# Altium schematic sheet Alarm.SchDoc
size A4
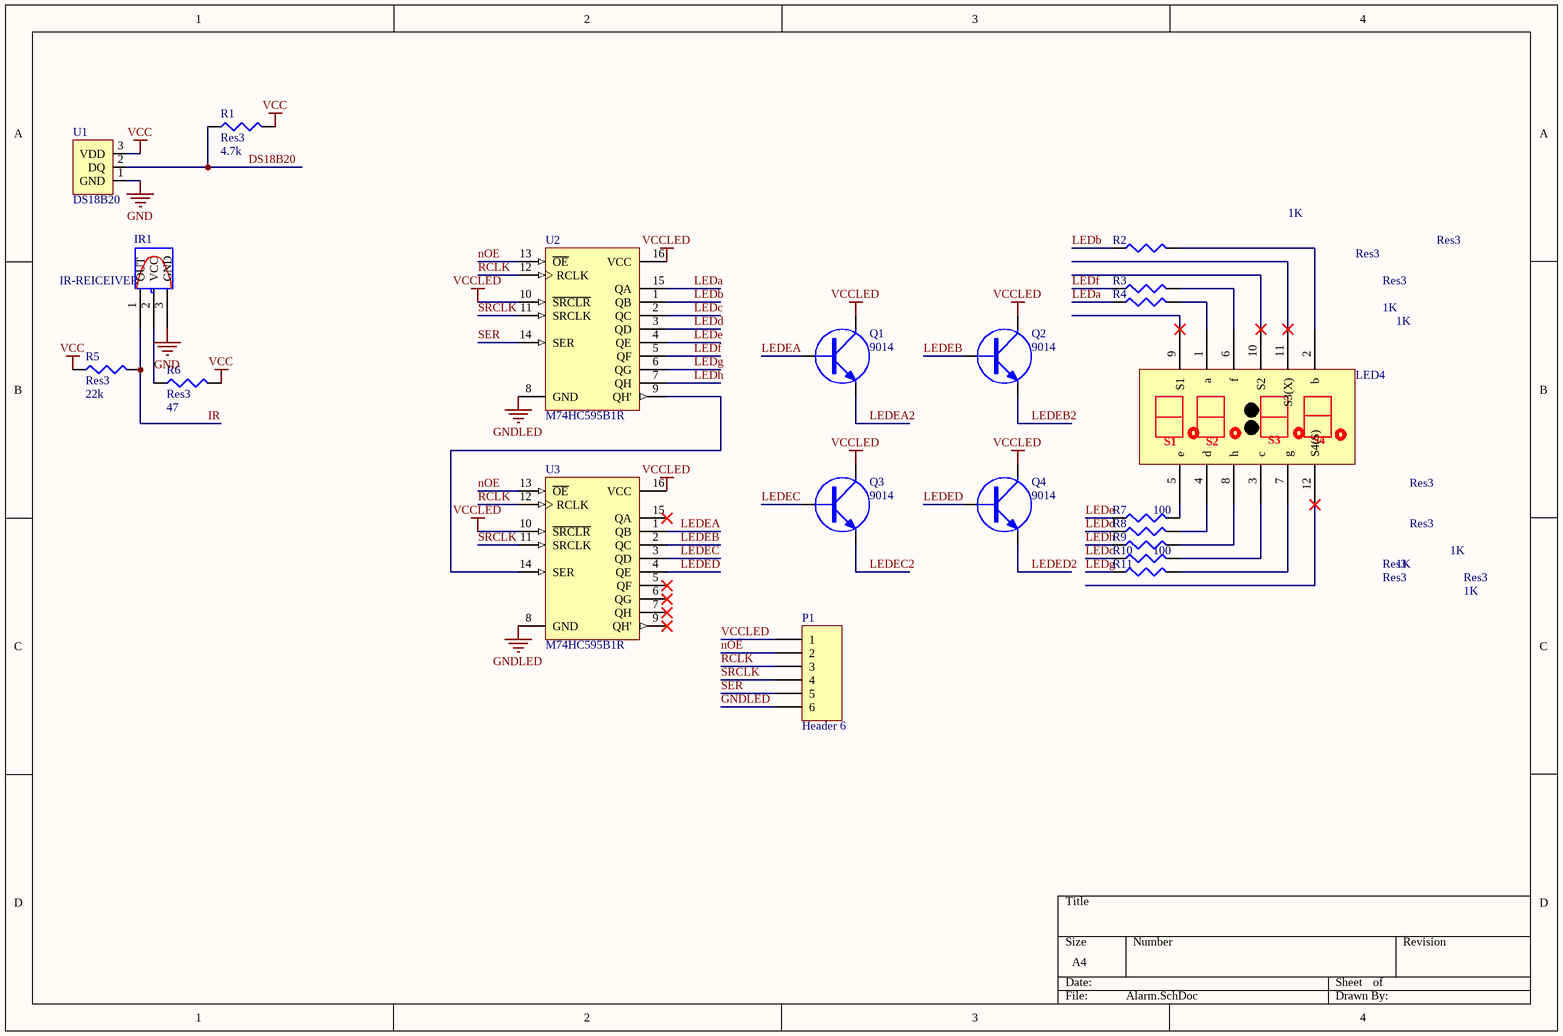
[diagram p0: Alarm.SchDoc]

## Parts
?  LED4
IR1  IR-REICEIVER
P1  Header 6  [HDR1X6]
Q1  9014  [TO-92A]
Q2  9014  [TO-92A]
Q3  9014  [TO-92A]
Q4  9014  [TO-92A]
R1  Res3  value 4.7k  [J1-0603]
R2  Res3  value 1K  [J1-0603]
R3  Res3  value 1K  [J1-0603]
R4  Res3  value 1K  [J1-0603]
R5  Res3  value 22k  [J1-0603]
R6  Res3  value 47  [J1-0603]
R7  Res3  value 100  [J1-0603]
R8  Res3  value 1K  [J1-0603]
R9  Res3  value 1K  [J1-0603]
R10  Res3  value 100  [J1-0603]
R11  Res3  value 1K  [J1-0603]
U1  DS18B20
U2  M74HC595B1R  [DIP16]
U3  M74HC595B1R  [DIP16]

## Nets
GND: IR1.3(GND) U1.1(GND)
GNDLED: P1.6 U2.8(GND) U3.8(GND)
VCC: R1.2 R5.1 R6.2 U1.3(VDD)
VCCLED: P1.1 Q1.3 Q2.3 Q3.3 Q4.3 U2.10(~{SRCLR}) U2.16(VCC) U3.10(~{SRCLR}) U3.16(VCC)
DS18B20: R1.1 U1.2(DQ)
IR: IR1.1(OUT) R5.2
LEDa: R4.1 U2.15(QA)
LEDb: R2.1 U2.1(QB)
LEDc: R10.1 U2.2(QC)
LEDd: R8.1 U2.3(QD)
LEDe: R7.1 U2.4(QE)
LEDEA: Q1.2 U3.1(QB)
LEDEA2: Q1.1
LEDEB: Q2.2 U3.2(QC)
LEDEB2: Q2.1
LEDEC: Q3.2 U3.3(QD)
LEDEC2: Q3.1
LEDED: Q4.2 U3.4(QE)
LEDED2: Q4.1
LEDf: R3.1 U2.5(QF)
LEDg: R11.1 U2.6(QG)
LEDh: R9.1 U2.7(QH)
nOE: P1.2 U2.13(~{OE}) U3.13(~{OE})
RCLK: P1.3 U2.12(RCLK) U3.12(RCLK)
SER: P1.5 U2.14(SER)
SRCLK: P1.4 U2.11(SRCLK) U3.11(SRCLK)
Net?_1: ?.1(a) R4.2
Net?_2: ?.2(b) R2.2
Net?_3: ?.3(c) R10.2
Net?_4: ?.4(d) R8.2
Net?_5: ?.5(e) R7.2
Net?_6: ?.6(f) R3.2
Net?_7: ?.7(g) R11.2
Net?_8: ?.8(h) R9.2
NetIR1_2: IR1.2(VCC) R6.1
NetU2_9: U2.9(QH') U3.14(SER)

Not connected (* = marked no-connect by the designer): ? 9(S1)* 10(S2)* 11(S3(X))* 12(S4(S))*; U3 5(QF)* 6(QG)* 7(QH)* 9(QH')* 15(QA)*

## Notes on the sheet
- (in symbol LED4) S3; S4

## Library data of the parts
P1 = Header 6: Header, 6-Pin; LatestRevisionDate: 17-Jul-2002; LatestRevisionNote: Re-released for DXP Platform.; Publisher: Altium Limited
R1-R11 = Res3: Resistor; Published: 8-Jun-2000; LatestRevisionDate: 29-May-2009; LatestRevisionNote: IPC-7351 Footprint Added.; PackageReference: J1-0603; Publisher: Altium Limited; PackageDescription: Chip Resistor
U2 U3 = M74HC595B1R: 8 Bit Shift Register with Output Latches (3 STATE); Published: 8-Jun-2000; LatestRevisionDate: 06-Jun-2005; LatestRevisionNote: Stylized 3D Model Added.; DatasheetVersion: Apr-1993; PackageVersion: Apr-1996; PackageReference: DIP16; Publisher: Altium Limited; PackageDescription: DIP; 16 Leads; Row Spacing 7.62 mm; Pitch 2.54 mm; ComponentLink1Description: Manufacturer Link; ComponentLink1URL: http://www.st.com/; ComponentLink2Description: Datasheet; ComponentLink2URL: http://www.st.com/stonline/products/literature/ds/1989/m74hc595.pdf